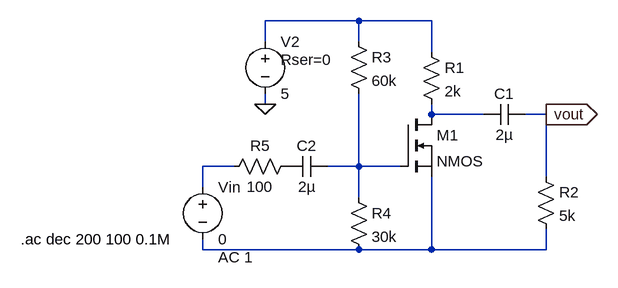
[diagram p0: schematic cs_amplifier_ac_analysis.asc]
cs_amplifier_ac_analysis.asc, the LTspice schematic file:
Version 4
SHEET 1 880 680
WIRE 0 -192 -144 -192
WIRE 112 -192 0 -192
WIRE -144 -160 -144 -192
WIRE 0 -160 0 -192
WIRE 112 -144 112 -192
WIRE -144 -64 -144 -80
WIRE 112 -48 112 -64
WIRE 192 -48 112 -48
WIRE 288 -48 256 -48
WIRE -192 32 -240 32
WIRE 0 32 0 -80
WIRE 0 32 -48 32
WIRE 64 32 0 32
WIRE 288 48 288 -48
WIRE -240 64 -240 32
WIRE 0 80 0 32
WIRE -240 160 -240 144
WIRE 0 160 -240 160
WIRE 112 160 112 48
WIRE 112 160 0 160
WIRE 288 160 288 128
WIRE 288 160 112 160
FLAG -144 -64 0
FLAG 288 -48 vout
IOPIN 288 -48 Out
SYMBOL nmos 64 -48 R0
SYMATTR InstName M1
SYMBOL res 96 -160 R0
SYMATTR InstName R1
SYMATTR Value 2k
SYMBOL cap 256 -64 R90
WINDOW 0 0 32 VBottom 2
WINDOW 3 32 32 VTop 2
SYMATTR InstName C1
SYMATTR Value 2µ
SYMBOL res 272 32 R0
SYMATTR InstName R2
SYMATTR Value 5k
SYMBOL res -16 -176 R0
SYMATTR InstName R3
SYMATTR Value 60k
SYMBOL res -16 64 R0
SYMATTR InstName R4
SYMATTR Value 30k
SYMBOL cap -48 16 R90
WINDOW 0 0 32 VBottom 2
WINDOW 3 32 32 VTop 2
SYMATTR InstName C2
SYMATTR Value 2µ
SYMBOL res -96 16 R90
WINDOW 0 0 56 VBottom 2
WINDOW 3 32 56 VTop 2
SYMATTR InstName R5
SYMATTR Value 100
SYMBOL voltage -240 48 R0
WINDOW 123 24 124 Left 2
WINDOW 39 0 0 Left 0
SYMATTR Value2 AC 1
SYMATTR InstName Vin
SYMATTR Value 0
SYMBOL voltage -144 -176 R0
WINDOW 123 0 0 Left 0
WINDOW 39 24 44 Left 2
SYMATTR SpiceLine Rser=0
SYMATTR InstName V2
SYMATTR Value 5
TEXT -520 144 Left 2 !.ac dec 200 100 0.1M

The netlist it stands for:
* cs_amplifier_ac_analysis.asc
M1 N002 N004 N005 N005 NMOS
R1 N001 N002 2k
C1 vout N002 2µ
R2 vout N005 5k
R3 N001 N004 60k
R4 N004 N005 30k
C2 N004 P001 2µ
R5 P001 N003 100
Vin N003 N005 0 AC 1
V2 N001 0 5 Rser=0
.model NMOS NMOS
.model PMOS PMOS
.lib standard.mos
.ac dec 200 100 0.1M
.backanno
.end